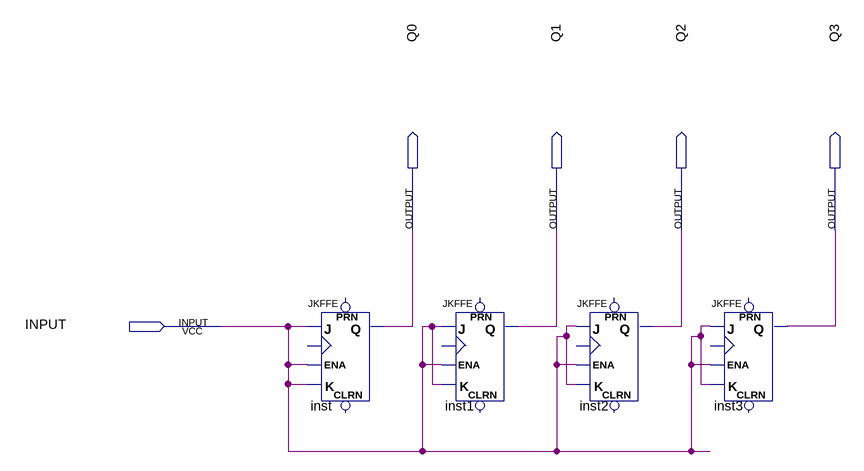
[diagram p0: schematic sheet]
// Quartus schematic Lab_6_4.bdf as structural Verilog: 4 symbols, 5 pins
module Lab_6_4 (
  input  INPUT,
  output Q0,
  output Q1,
  output Q2,
  output Q3
);

  JKFFE inst (.J(INPUT), .K(INPUT), .ENA(INPUT), .Q(Q0));  // open: PRN, CLK, CLRN
  JKFFE inst1 (.J(INPUT), .K(INPUT), .ENA(INPUT), .Q(Q1));  // open: PRN, CLK, CLRN
  JKFFE inst2 (.J(INPUT), .K(INPUT), .ENA(INPUT), .Q(Q2));  // open: PRN, CLK, CLRN
  JKFFE inst3 (.J(INPUT), .K(INPUT), .ENA(INPUT), .Q(Q3));  // open: PRN, CLK, CLRN
endmodule
